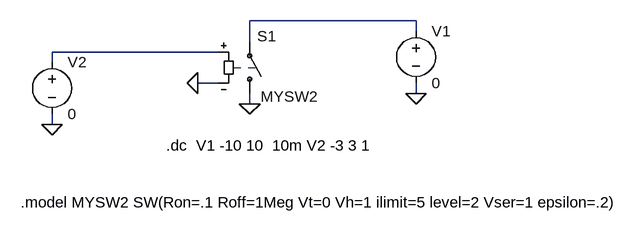
[diagram p0: schematic curvetrace.asc]
curvetrace.asc, the LTspice schematic file:
Version 4
SHEET 1 1276 680
WIRE 496 112 240 112
WIRE 496 128 496 112
WIRE 240 144 240 112
WIRE 192 160 -64 160
WIRE -64 176 -64 160
WIRE 192 208 160 208
WIRE 496 224 496 208
WIRE 240 240 240 224
WIRE -64 272 -64 256
FLAG -64 272 0
FLAG 496 224 0
FLAG 240 240 0
FLAG 160 208 0
SYMBOL sw 240 240 M180
WINDOW 0 12 104 Left 2
WINDOW 3 17 11 Left 2
SYMATTR InstName S1
SYMATTR Value MYSW2
SYMBOL voltage -64 160 R0
SYMATTR InstName V2
SYMATTR Value 0
SYMBOL voltage 496 112 R0
SYMATTR InstName V1
SYMATTR Value 0
TEXT 112 304 Left 2 !.dc  V1 -10 10  10m V2 -3 3 1
TEXT -112 392 Left 2 !.model MYSW2 SW(Ron=.1 Roff=1Meg Vt=0 Vh=1 ilimit=5 level=2 Vser=1 epsilon=.2)

The netlist it stands for:
* curvetrace.asc
S1 0 N001 N002 0 MYSW2
V2 N002 0 0
V1 N001 0 0
.dc  V1 -10 10  10m V2 -3 3 1
.model MYSW2 SW(Ron=.1 Roff=1Meg Vt=0 Vh=1 ilimit=5 level=2 Vser=1 epsilon=.2)
.backanno
.end